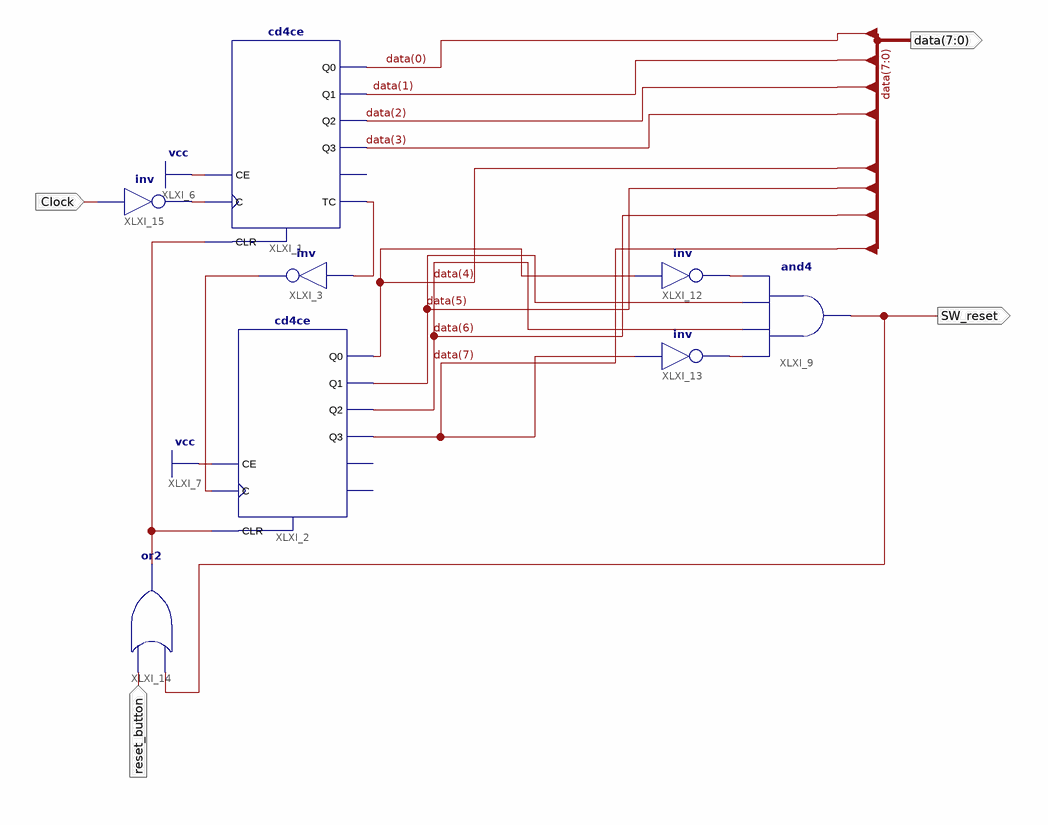
[diagram p0: schematic sheet 1]
// Xilinx ISE schematic controller00to59.sch (spartan6) as structural Verilog: 8 symbols, 4 ports
module controller00to59 (
  input  reset_button,
  input  Clock,
  output SW_reset,
  output [7:0] data
);

  wire XLXN_2, XLXN_3, XLXN_22, XLXN_23, XLXN_26, XLXN_37;

  cd4ce XLXI_1 (
    .C(XLXN_37), .CE(1'b1), .CLR(XLXN_26), .Q0(data[0]), .Q1(data[1]), .Q2(data[2]), .Q3(data[3]), .TC(XLXN_2));  // open: CEO
  cd4ce XLXI_2 (
    .C(XLXN_3), .CE(1'b1), .CLR(XLXN_26), .Q0(data[4]), .Q1(data[5]), .Q2(data[6]), .Q3(data[7]));  // open: CEO, TC
  not XLXI_3 (XLXN_3, XLXN_2);
  and XLXI_9 (SW_reset, XLXN_23, data[6], data[5], XLXN_22);
  not XLXI_12 (XLXN_22, data[4]);
  not XLXI_13 (XLXN_23, data[7]);
  or XLXI_14 (XLXN_26, SW_reset, reset_button);
  not XLXI_15 (XLXN_37, Clock);
endmodule
